# EAGLE schematic output (EAGLE 6.6.0)
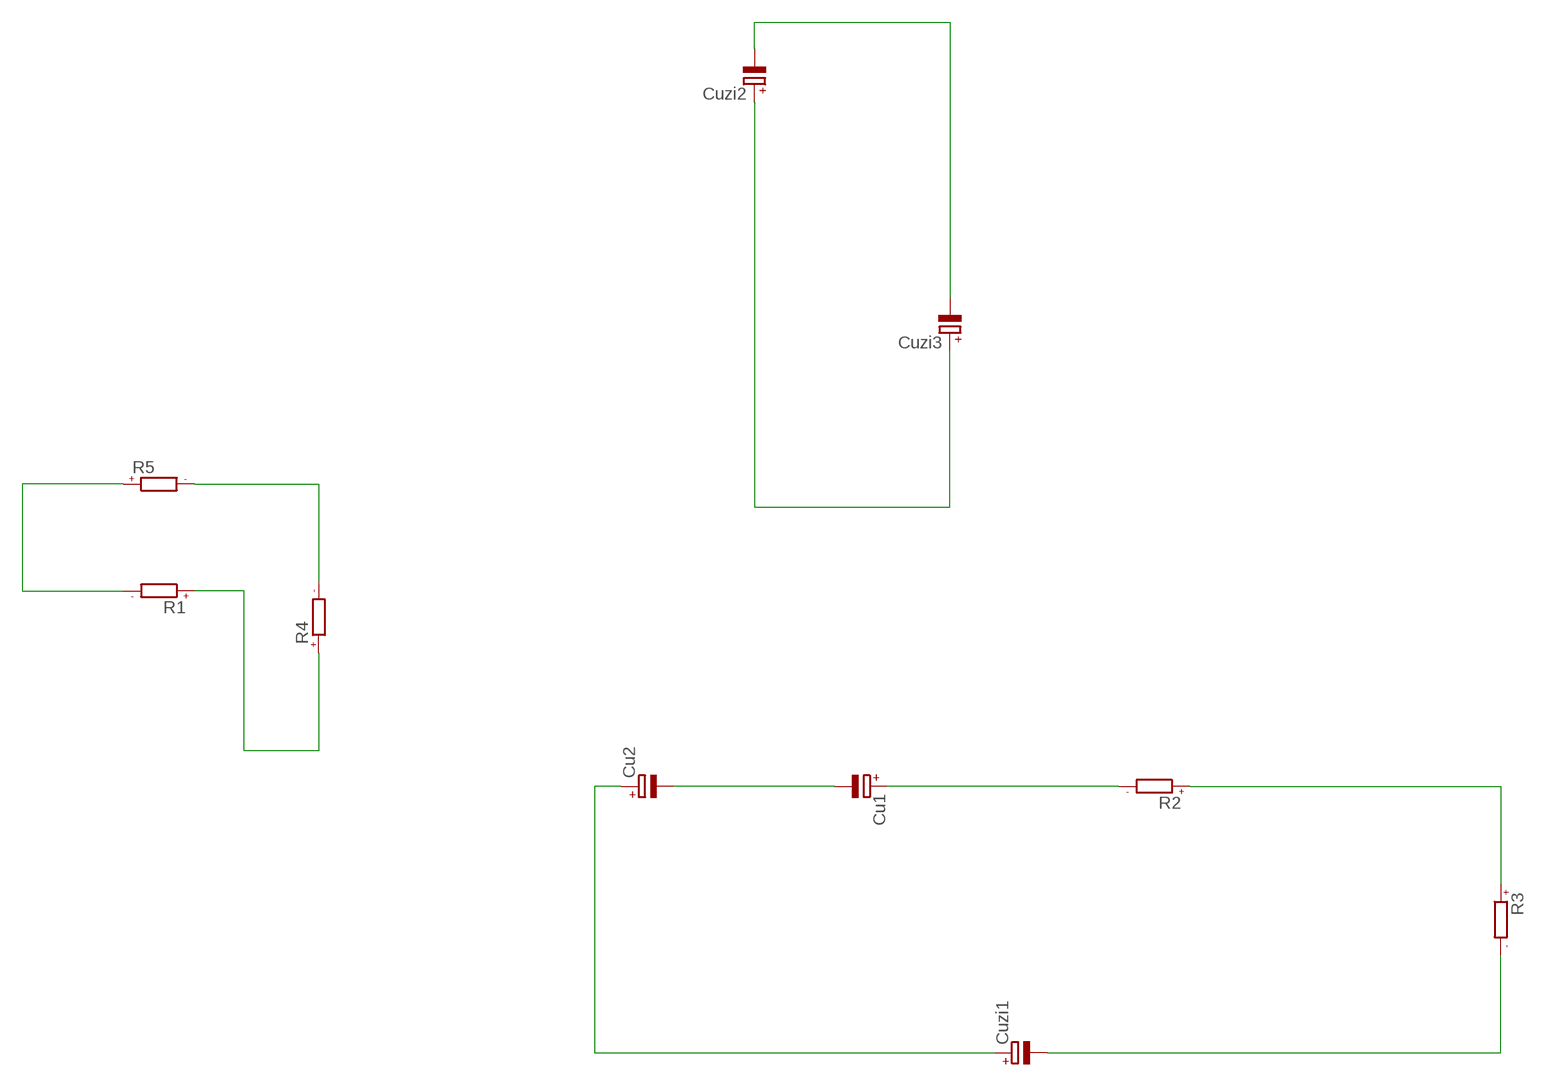
[diagram p0: schematic, sheet 1]

## Parts
Cu1  CPOL-EU085CS-1AR  [085CS_1AR]
Cu2  CPOL-EU085CS-1AR  [085CS_1AR]
Cuzi1  CPOL-EU085CS-1AR  [085CS_1AR]
Cuzi2  CPOL-EU085CS-1AR  [085CS_1AR]
Cuzi3  CPOL-EU085CS-1AR  [085CS_1AR]
R1  R-EU_0204/5  [0204/5]
R2  R-EU_0204/5  [0204/5]
R3  R-EU_0204/5  [0204/5]
R4  R-EU_0204/5  [0204/5]
R5  R-EU_0204/5  [0204/5]
Unconnected: Cu1.+ Cu1.- Cu2.+ Cu2.- Cuzi1.+ Cuzi1.- Cuzi2.+ Cuzi2.- Cuzi3.+ Cuzi3.- R1.1 R1.2 R2.1 R2.2 R3.1 R3.2 R4.1 R4.2 R5.1 R5.2

## Library data of the parts
Cu1 Cu2 Cuzi1-Cuzi3 = rcl:CPOL-EU: POLARIZED CAPACITOR, European symbol; VITRUV_ID: 1
R1-R5 = rcl:R-EU_: RESISTOR, European symbol; VITRUV_ID: 0